# Altium schematic sheet IrRC_Receiver.SchDoc
size A4; Organization: Altium Limited; Address1: 3 Minna Close; Address2: Belrose; Address3: NSW 2086; Address4: Australia
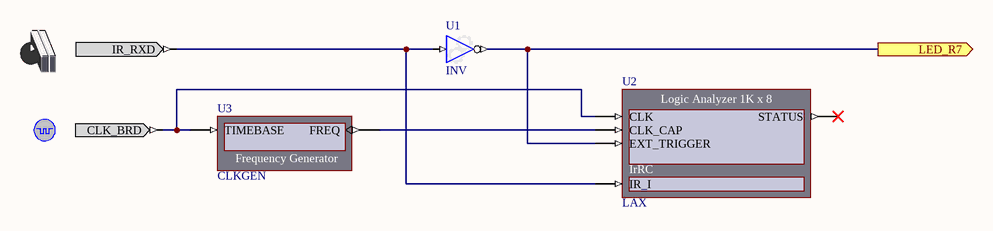
[diagram p0: IrRC_Receiver.SchDoc]

## Parts
(Parts that share a designator on the sheet are numbered #1, #2 ... from top to bottom, then left to right.)
?#1  IR  (value not drawn)
?#2  CLOCK_BOARD  (value not drawn)
U1  INV
U2  LAX
U3  CLKGEN

## Ports
LED_R7 (out, see P1)

## Nets
GND_BUS[6..0]: U2.Set0_Spare[6..0]
LED_R7: U1.O U2.EXT_TRIGGER ; port LED_R7
Net?#1_IR_RXD: ?#1.IR_RXD U1.I U2.IR_I
Net?#2_CLK_BRD: ?#2.CLK_BRD U2.CLK U3.TIMEBASE
NetU2_CLK_CAP: U2.CLK_CAP U3.FREQ

Not connected (* = marked no-connect by the designer): U2 STATUS*

## Notes on the sheet
- (in symbol LAX) Logic Analyzer 1K x 8; IrRC

## Library data of the parts
?#1 = IR: 4 Mbits/s IRDA; PortComponent: True; Published: 22-Jan-2007; Publisher: Altium Limited; HelpURL: TR0147 Technical Reference for Altium's USB-IrDA-Ethernet Peripheral Board PB03.pdf#page=10
?#2 = CLOCK_BOARD: Global System Clock Supply; PortComponent: True; Published: 19-Nov-2003; Publisher: Altium Limited; HelpURL: https://wiki.altium.com/display/ADOH/NanoBoard+3000+-+System+Clocks; UseInDSF: True
U1 = INV: Configurable Inverter; ConfigurationParameters: {}Version[1.1]{}SignalCount[1]{}SignalWidth0[1]{}OutputOption0[Inverted]{}EnableMode[None]{}ShowPinNames[False]{}; ConfiguratorName: GENERIC_BUFFER; LastRevisionNo: 1.00.00; Published: 10-Oct-2008; Publisher: Altium Limited
U2 = LAX: Configurable Logic Analyzer; NEXUS_CORE: Instrument; NEXUS_JTAG_DEVICE: True; NEXUS_JTAG_ORDER: 0; ConfiguratorName: LogicAnalyser; ConfigurationParameters: {}Version[1.0]{}CaptureWidth[8]{}MemorySize[1K]{}ExtAddrWidth[10]{}Set0[IrRC]{}Set0_Signal0[IR_I]{}Style_Set0_Signal0[Default]{}ConnectSpareToGND[True]{}; ChildModel1: LAX_CFG8; Published: 12-Oct-2005; Publisher: Altium Limited; Core Revision: 1.00.00; HelpURL: https://wiki.altium.com/display/ADOH/Logic+Analyzer; LastRevisionNo: 1.00.00; ComponentLink1Description: Core &Resource Usage; ComponentLink1URL: CR0134 FPGA Instrument Resource Usage.pdf#page=10
U3 = CLKGEN: Frequency Generator; NEXUS_CORE: Instrument; NEXUS_JTAG_DEVICE: True; NEXUS_JTAG_ORDER: 0; Published: 3-Nov-2004; Publisher: Altium Limited; Core Revision: 1.00.00; ComponentLink1Description: Core &Resource Usage; ComponentLink1URL: CR0134 FPGA Instrument Resource Usage.pdf#page=2; HelpURL: https://wiki.altium.com/display/ADOH/Frequency+Generator+Module; LastRevisionNo: 1.00.00